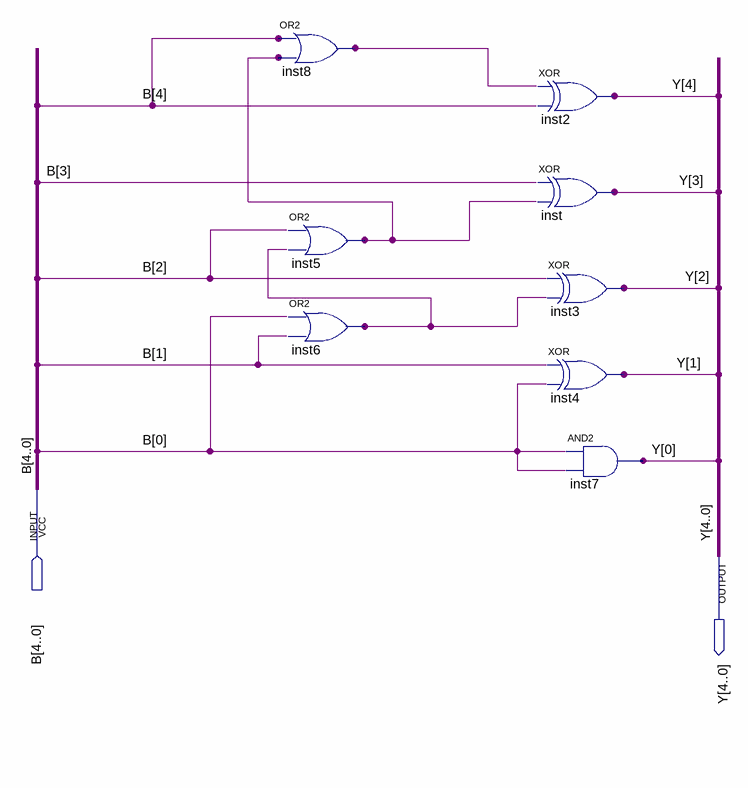
[diagram p0: schematic sheet]
// Quartus schematic ULA.bdf as structural Verilog: 8 symbols, 2 pins
module ULA (
  input  [4:0] B,
  output [4:0] Y
);

  wire inst5_out, inst6_out, inst8_out;

  or inst8 (inst8_out, B[4], inst5_out);
  // OR2 inst5 has open pins: IN1=open, IN2=open, OUT=inst5_out
  // OR2 inst6 has open pins: IN1=open, IN2=open, OUT=inst6_out
  // XOR inst2 has open pins: IN1=open, IN2=open, OUT=Y[4]
  // XOR inst has open pins: IN1=open, IN2=open, OUT=Y[3]
  // XOR inst3 has open pins: IN1=open, IN2=open, OUT=Y[2]
  // XOR inst4 has open pins: IN1=open, IN2=open, OUT=Y[1]
  // AND2 inst7 has open pins: IN1=open, IN2=open, OUT=Y[0]
endmodule
